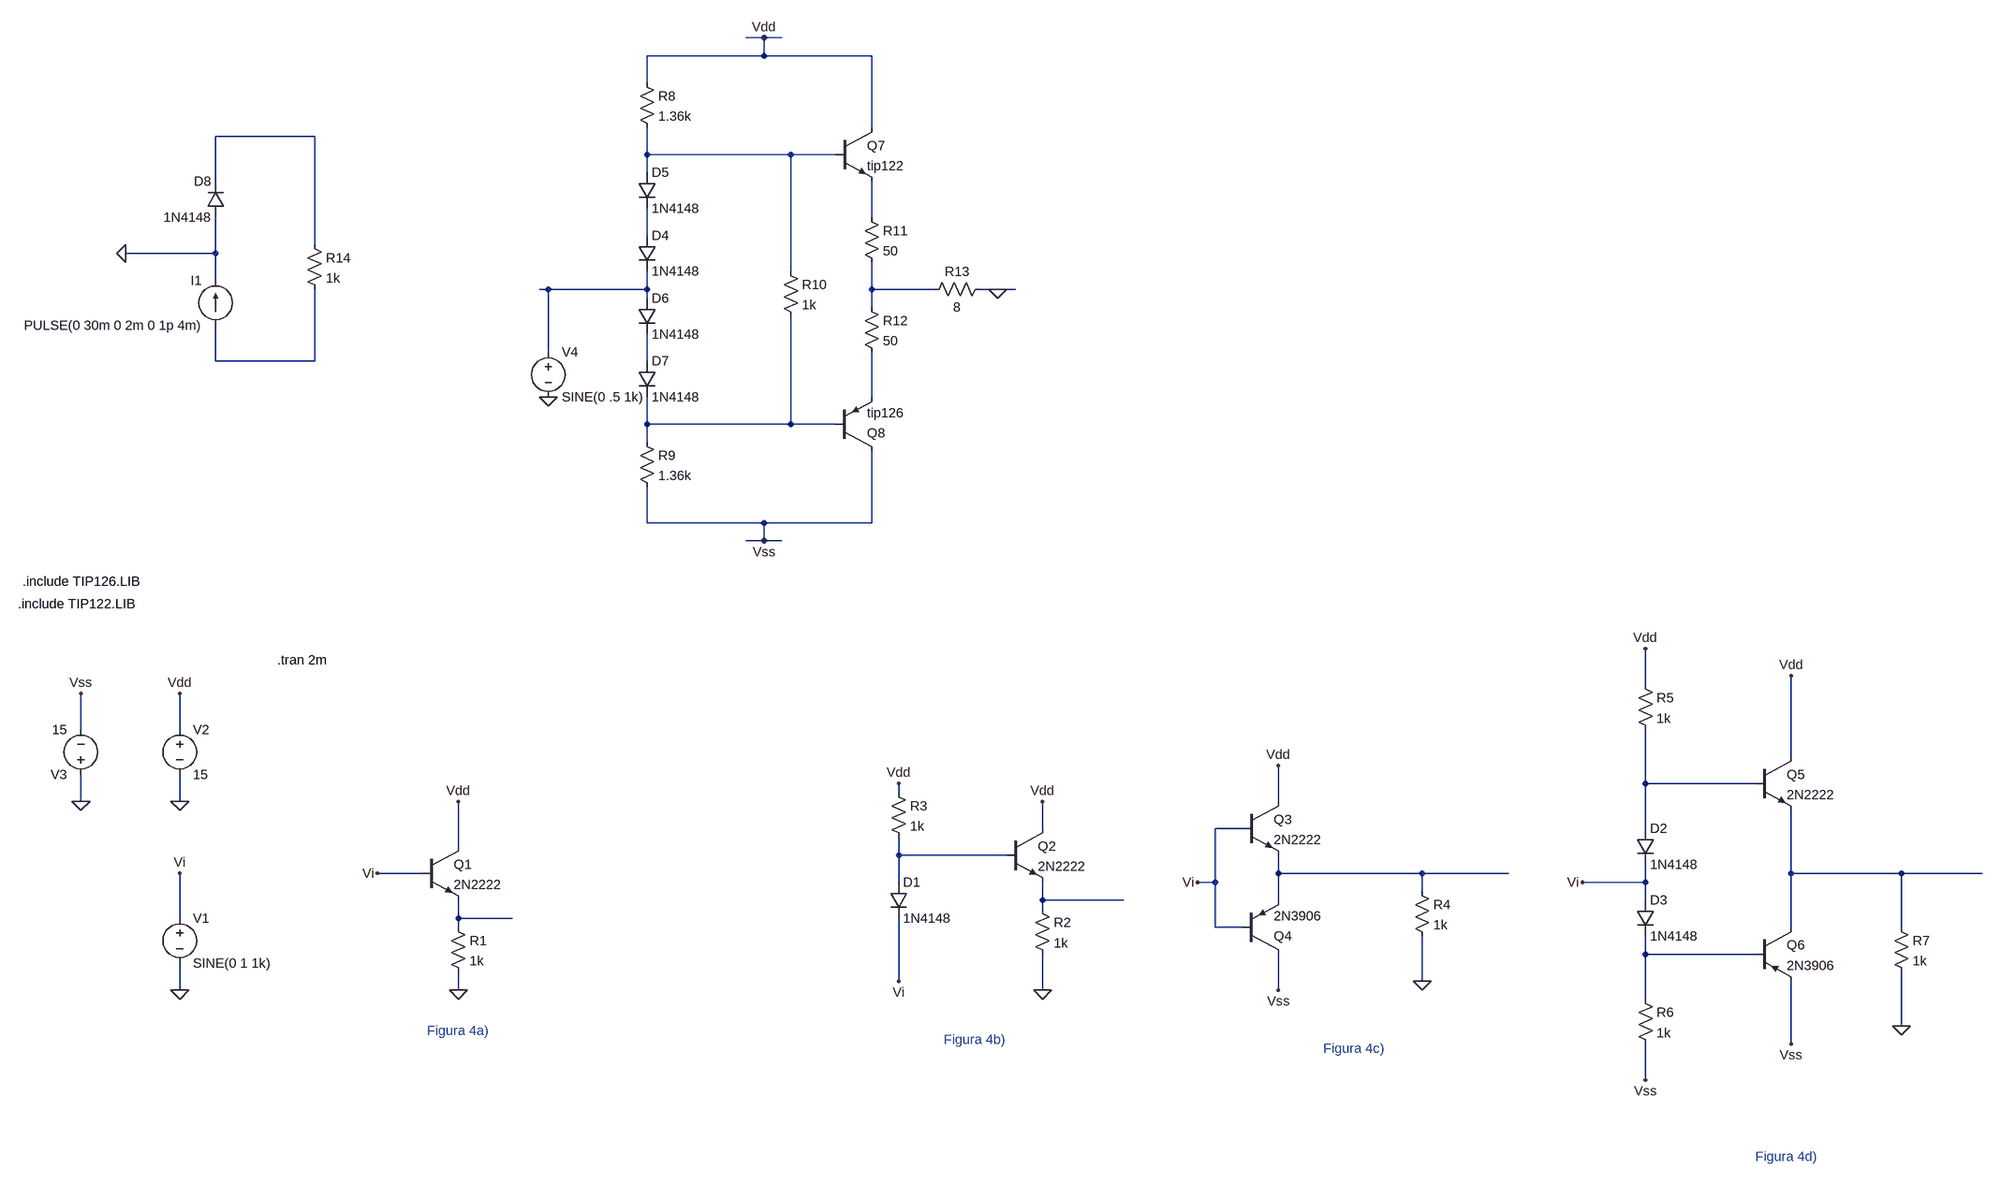
[diagram p0: schematic fig_4_5.asc]
fig_4_5.asc, the LTspice schematic file:
Version 4
SHEET 1 4400 904
WIRE 480 -1104 448 -1104
WIRE 512 -1104 480 -1104
WIRE 480 -1072 480 -1104
WIRE 480 -1072 272 -1072
WIRE 672 -1072 480 -1072
WIRE 272 -1024 272 -1072
WIRE 672 -944 672 -1072
WIRE -320 -928 -496 -928
WIRE 272 -896 272 -944
WIRE 528 -896 272 -896
WIRE 608 -896 528 -896
WIRE 272 -864 272 -896
WIRE -496 -848 -496 -928
WIRE 672 -784 672 -848
WIRE 272 -752 272 -800
WIRE -320 -736 -320 -928
WIRE -496 -720 -496 -784
WIRE -496 -720 -656 -720
WIRE 528 -688 528 -896
WIRE -496 -672 -496 -720
WIRE 96 -656 80 -656
WIRE 272 -656 272 -688
WIRE 272 -656 96 -656
WIRE 672 -656 672 -704
WIRE 784 -656 672 -656
WIRE 896 -656 864 -656
WIRE 928 -656 896 -656
WIRE 272 -640 272 -656
WIRE 672 -624 672 -656
WIRE 96 -544 96 -656
WIRE -496 -528 -496 -592
WIRE -320 -528 -320 -656
WIRE -320 -528 -496 -528
WIRE 272 -528 272 -576
WIRE 672 -464 672 -544
WIRE 272 -416 272 -464
WIRE 528 -416 528 -608
WIRE 528 -416 272 -416
WIRE 608 -416 528 -416
WIRE 272 -384 272 -416
WIRE 272 -240 272 -304
WIRE 480 -240 272 -240
WIRE 672 -240 672 -368
WIRE 672 -240 480 -240
WIRE 480 -208 480 -240
WIRE 480 -208 448 -208
WIRE 512 -208 480 -208
WIRE 2688 48 2688 -16
WIRE -736 128 -736 64
WIRE -560 128 -560 64
WIRE 3024 176 3024 32
WIRE 2688 224 2688 128
WIRE 2960 224 2688 224
WIRE 720 240 720 224
WIRE -736 256 -736 208
WIRE -560 256 -560 208
WIRE 1776 256 1776 192
WIRE 976 304 976 256
WIRE 1712 304 1664 304
WIRE 2688 304 2688 224
WIRE -64 336 -64 256
WIRE 720 352 720 320
WIRE 912 352 720 352
WIRE -128 384 -208 384
WIRE 1776 384 1776 352
WIRE 2032 384 1776 384
WIRE 2208 384 2032 384
WIRE 3024 384 3024 272
WIRE 3312 384 3024 384
WIRE 3456 384 3312 384
WIRE 720 400 720 352
WIRE 1664 400 1664 304
WIRE 1664 400 1632 400
WIRE 2688 400 2688 368
WIRE 2688 400 2576 400
WIRE 2032 416 2032 384
WIRE 976 432 976 400
WIRE 1120 432 976 432
WIRE 1776 432 1776 384
WIRE 2688 432 2688 400
WIRE 976 448 976 432
WIRE -560 464 -560 384
WIRE -64 464 -64 432
WIRE 32 464 -64 464
WIRE -64 480 -64 464
WIRE 1664 480 1664 400
WIRE 1712 480 1664 480
WIRE 3024 480 3024 384
WIRE 3312 480 3312 384
WIRE 2688 528 2688 496
WIRE 2960 528 2688 528
WIRE 720 576 720 464
WIRE 2032 576 2032 496
WIRE -560 592 -560 544
WIRE -64 592 -64 560
WIRE 976 592 976 528
WIRE 1776 592 1776 528
WIRE 2688 608 2688 528
WIRE 3312 656 3312 560
WIRE 3024 688 3024 576
WIRE 2688 752 2688 688
FLAG -64 592 0
FLAG -64 256 Vdd
FLAG -560 592 0
FLAG -560 256 0
FLAG -560 64 Vdd
FLAG -560 384 Vi
FLAG 976 592 0
FLAG 976 256 Vdd
FLAG 720 224 Vdd
FLAG 720 576 Vi
FLAG -208 384 Vi
FLAG -736 256 0
FLAG -736 64 Vss
FLAG 1776 192 Vdd
FLAG 1776 592 Vss
FLAG 1632 400 Vi
FLAG 2032 576 0
FLAG 3024 688 Vss
FLAG 3024 32 Vdd
FLAG 2688 -16 Vdd
FLAG 2688 752 Vss
FLAG 3312 656 0
FLAG 2576 400 Vi
FLAG 480 -1104 Vdd
FLAG 480 -208 Vss
FLAG -656 -720 0
FLAG 96 -464 0
FLAG 896 -656 0
SYMBOL npn -128 336 R0
SYMATTR InstName Q1
SYMATTR Value 2N2222
SYMBOL res -80 464 R0
SYMATTR InstName R1
SYMATTR Value 1k
SYMBOL voltage -560 448 R0
WINDOW 123 0 0 Left 0
WINDOW 39 0 0 Left 0
SYMATTR InstName V1
SYMATTR Value SINE(0 1 1k)
SYMBOL voltage -560 112 R0
WINDOW 123 0 0 Left 0
WINDOW 39 0 0 Left 0
SYMATTR InstName V2
SYMATTR Value 15
SYMBOL npn 912 304 R0
SYMATTR InstName Q2
SYMATTR Value 2N2222
SYMBOL res 960 432 R0
SYMATTR InstName R2
SYMATTR Value 1k
SYMBOL res 704 224 R0
SYMATTR InstName R3
SYMATTR Value 1k
SYMBOL diode 704 400 R0
SYMATTR InstName D1
SYMATTR Value 1N4148
SYMBOL npn 1712 256 R0
SYMATTR InstName Q3
SYMATTR Value 2N2222
SYMBOL res 2016 400 R0
SYMATTR InstName R4
SYMATTR Value 1k
SYMBOL voltage -736 224 R180
WINDOW 123 0 0 Left 0
WINDOW 39 0 0 Left 0
SYMATTR InstName V3
SYMATTR Value 15
SYMBOL npn 2960 176 R0
SYMATTR InstName Q5
SYMATTR Value 2N2222
SYMBOL pnp 2960 480 R0
SYMATTR InstName Q6
SYMATTR Value 2N3906
SYMBOL diode 2672 304 R0
SYMATTR InstName D2
SYMATTR Value 1N4148
SYMBOL diode 2672 432 R0
SYMATTR InstName D3
SYMATTR Value 1N4148
SYMBOL res 2672 32 R0
SYMATTR InstName R5
SYMATTR Value 1k
SYMBOL res 2672 592 R0
SYMATTR InstName R6
SYMATTR Value 1k
SYMBOL res 3296 464 R0
SYMATTR InstName R7
SYMATTR Value 1k
SYMBOL pnp 1712 528 M180
SYMATTR InstName Q4
SYMATTR Value 2N3906
SYMBOL res 256 -1040 R0
SYMATTR InstName R8
SYMATTR Value 1.36k
SYMBOL res 256 -400 R0
SYMATTR InstName R9
SYMATTR Value 1.36k
SYMBOL diode 256 -752 R0
SYMATTR InstName D4
SYMATTR Value 1N4148
SYMBOL diode 256 -864 R0
SYMATTR InstName D5
SYMATTR Value 1N4148
SYMBOL diode 256 -640 R0
SYMATTR InstName D6
SYMATTR Value 1N4148
SYMBOL diode 256 -528 R0
SYMATTR InstName D7
SYMATTR Value 1N4148
SYMBOL res 512 -704 R0
SYMATTR InstName R10
SYMATTR Value 1k
SYMBOL npn 608 -944 R0
SYMATTR InstName Q7
SYMATTR Value tip122
SYMATTR Prefix X
SYMBOL pnp 608 -368 M180
SYMATTR InstName Q8
SYMATTR Value tip126
SYMATTR Prefix X
SYMBOL res 656 -800 R0
SYMATTR InstName R11
SYMATTR Value 50
SYMBOL res 656 -640 R0
SYMATTR InstName R12
SYMATTR Value 50
SYMBOL res 880 -672 R90
WINDOW 0 0 56 VBottom 2
WINDOW 3 32 56 VTop 2
SYMATTR InstName R13
SYMATTR Value 8
SYMBOL diode -480 -784 R180
WINDOW 0 24 64 Left 2
WINDOW 3 24 0 Left 2
SYMATTR InstName D8
SYMATTR Value 1N4148
SYMBOL current -496 -592 R180
WINDOW 0 24 80 Left 2
WINDOW 3 24 0 Left 2
WINDOW 123 0 0 Left 0
WINDOW 39 0 0 Left 0
SYMATTR InstName I1
SYMATTR Value PULSE(0 30m 0 2m 0 1p 4m)
SYMBOL res -336 -752 R0
SYMATTR InstName R14
SYMATTR Value 1k
SYMBOL voltage 96 -560 R0
WINDOW 123 0 0 Left 0
WINDOW 39 0 0 Left 0
SYMATTR InstName V4
SYMATTR Value SINE(0 .5 1k)
TEXT -120 664 Left 2 ;Figura 4a)
TEXT -386 4 Left 2 !.tran 2m
TEXT 800 680 Left 2 ;Figura 4b)
TEXT 1856 696 Left 2 ;Figura 4c)
TEXT 2960 888 Left 2 ;Figura 4d)
TEXT -848 -96 Left 2 !.include TIP122.LIB
TEXT -840 -136 Left 2 !.include TIP126.LIB

The netlist it stands for:
* fig_4_5.asc
Q1 Vdd Vi N016 0 2N2222
R1 N016 0 1k
V1 Vi 0 SINE(0 1 1k)
V2 Vdd 0 15
Q2 Vdd N012 N015 0 2N2222
R2 N015 0 1k
R3 Vdd N012 1k
D1 N012 Vi 1N4148
Q3 Vdd Vi N013 0 2N2222
R4 N013 0 1k
V3 0 Vss 15
Q5 Vdd N011 N014 0 2N2222
Q6 N014 N017 Vss 0 2N3906
D2 N011 Vi 1N4148
D3 Vi N017 1N4148
R5 Vdd N011 1k
R6 N017 Vss 1k
R7 N014 0 1k
Q4 Vss Vi N013 0 2N3906
R8 Vdd N002 1.36k
R9 N010 Vss 1.36k
D4 N004 N005 1N4148
D5 N002 N004 1N4148
D6 N005 N008 1N4148
D7 N008 N010 1N4148
R10 N002 N010 1k
XQ7 Vdd N002 N003 tip122  ; pins C B E
XQ8 Vss N010 N009 tip126  ; pins C B E
R11 N003 N006 50
R12 N006 N009 50
R13 0 N006 8
D8 0 N001 1N4148
I1 N007 0 PULSE(0 30m 0 2m 0 1p 4m)
R14 N001 N007 1k
V4 N005 0 SINE(0 .5 1k)
.model D D
.lib standard.dio
.model NPN NPN
.model PNP PNP
.lib standard.bjt
* Figura 4a)
.tran 2m
* Figura 4b)
* Figura 4c)
* Figura 4d)
.include TIP122.LIB
.include TIP126.LIB
.backanno
.end